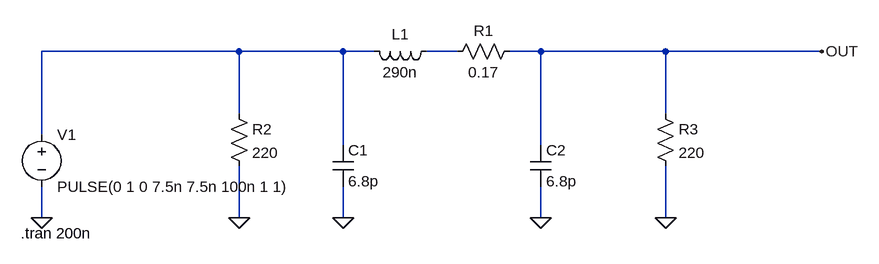
[diagram p0: schematic 1 cell.asc]
1 cell.asc, the LTspice schematic file:
Version 4
SHEET 1 1252 680
WIRE 288 0 -16 0
WIRE 448 0 288 0
WIRE 496 0 448 0
WIRE 624 0 576 0
WIRE 752 0 704 0
WIRE 944 0 752 0
WIRE 1184 0 944 0
WIRE 288 96 288 0
WIRE 944 96 944 0
WIRE -16 128 -16 0
WIRE 448 144 448 0
WIRE 752 144 752 0
WIRE -16 256 -16 208
WIRE 288 256 288 176
WIRE 448 256 448 208
WIRE 752 256 752 208
WIRE 944 256 944 176
FLAG -16 256 0
FLAG 448 256 0
FLAG 752 256 0
FLAG 288 256 0
FLAG 944 256 0
FLAG 1184 0 OUT
SYMBOL voltage -16 112 R0
WINDOW 123 0 0 Left 0
WINDOW 39 0 0 Left 0
SYMATTR InstName V1
SYMATTR Value PULSE(0 1 0 7.5n 7.5n 100n 1 1)
SYMBOL ind 592 -16 R90
WINDOW 0 5 56 VBottom 2
WINDOW 3 32 56 VTop 2
SYMATTR InstName L1
SYMATTR Value 290n
SYMBOL cap 432 144 R0
SYMATTR InstName C1
SYMATTR Value 6.8p
SYMBOL cap 736 144 R0
SYMATTR InstName C2
SYMATTR Value 6.8p
SYMBOL res 720 -16 R90
WINDOW 0 0 56 VBottom 2
WINDOW 3 32 56 VTop 2
SYMATTR InstName R1
SYMATTR Value 0.17
SYMBOL res 272 80 R0
SYMATTR InstName R2
SYMATTR Value 220
SYMBOL res 928 80 R0
SYMATTR InstName R3
SYMATTR Value 220
TEXT -48 280 Left 2 !.tran 200n

The netlist it stands for:
* 1 cell.asc
V1 N001 0 PULSE(0 1 0 7.5n 7.5n 100n 1 1)
L1 N002 N001 290n
C1 N001 0 6.8p
C2 OUT 0 6.8p
R1 OUT N002 0.17
R2 N001 0 220
R3 OUT 0 220
.tran 200n
.backanno
.end